# Altium schematic sheet Connectors.SchDoc: Extension connectors
size A4; DocumentNumber: MB1136; Revision: C.3; SheetNumber: 4; SheetTotal: 4; Project: NUCLEO-XXXXRX
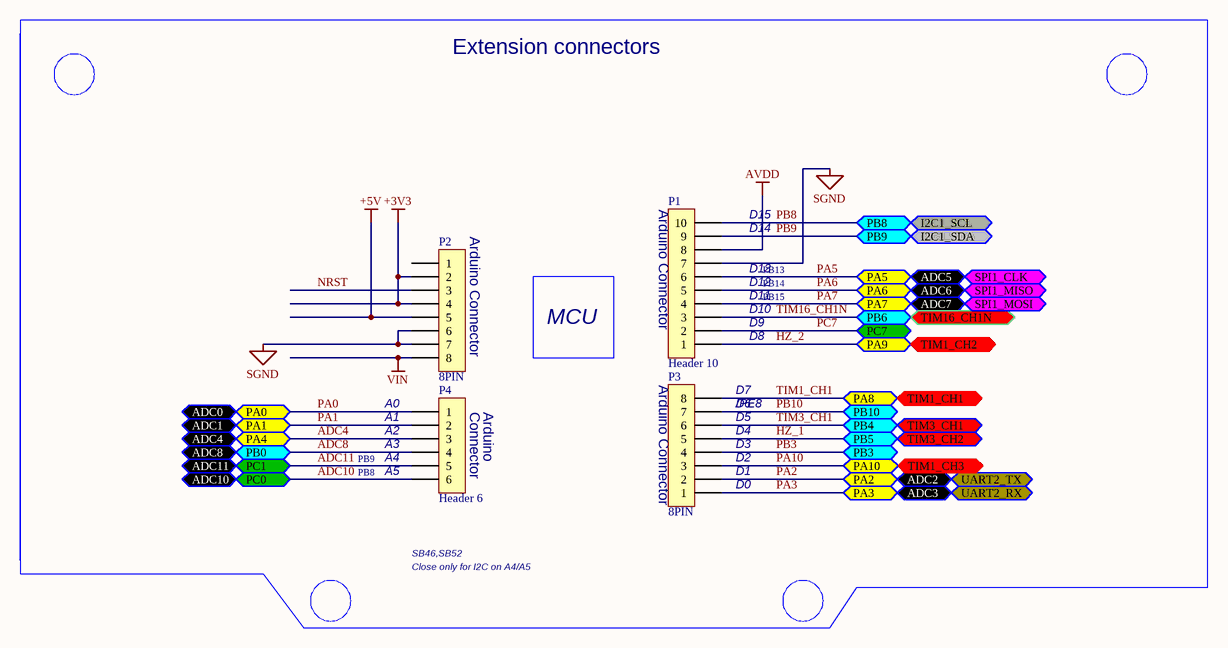
[diagram p0: Connectors.SchDoc]

## Parts
P1  Header 10  [CON10-P2.54]
P2  8PIN  [CON8-P2.54]
P3  8PIN  [CON8-P2.54]
P4  Header 6  [CON6-P2.54]

## Ports
ADC0 (bidir), ADC1 (bidir), ADC2 (bidir), ADC3 (bidir), ADC4 (bidir), ADC5 (bidir), ADC6 (bidir), ADC7 (bidir), ADC8 (bidir), ADC10 (bidir), ADC11 (bidir), I2C1_SCL (bidir), I2C1_SDA (bidir), PA0 (bidir), PA1, PA2, PA3, PA4, PA5, PA6, PA7, PA8, PA9, PA10, PB0, PB3, PB4, PB5, PB6, PB8, PB9, PB10, PC0, PC1, PC7, SPI1_CLK (bidir), SPI1_MISO (bidir), SPI1_MOSI (bidir), TIM1_CH1, TIM1_CH2, TIM1_CH3, TIM3_CH1, TIM3_CH2, TIM16_CH1N, UART2_RX (bidir), UART2_TX (bidir)

## Nets
+3V3: P2.2 P2.4
+5V: P2.5
AVDD: P1.8
SGND: P1.7 P2.6 P2.7
VIN: P2.8
ADC4: P4.3 ; port PA4, port ADC4
ADC8: P4.4 ; port PB0, port ADC8
ADC10: P4.6 ; port PC0, port ADC10
ADC11: P4.5 ; port PC1, port ADC11
HZ_1: P3.5 ; port PB5, port TIM3_CH2
HZ_2: P1.1 ; port PA9, port TIM1_CH2
NRST: P2.3
PA0: P4.1 ; port PA0, port ADC0
PA1: P4.2 ; port PA1, port ADC1
PA2: P3.2 ; port PA2, port ADC2, port UART2_TX
PA3: P3.1 ; port PA3, port ADC3, port UART2_RX
PA5: P1.6 ; port PA5, port ADC5, port SPI1_CLK
PA6: P1.5 ; port PA6, port ADC6, port SPI1_MISO
PA7: P1.4 ; port PA7, port ADC7, port SPI1_MOSI
PA10: P3.3 ; port PA10, port TIM1_CH3
PB3: P3.4 ; port PB3
PB8: P1.10 ; port PB8, port I2C1_SCL
PB9: P1.9 ; port PB9, port I2C1_SDA
PB10: P3.7 ; port PB10
PC7: P1.2 ; port PC7
TIM1_CH1: P3.8 ; port PA8, port TIM1_CH1
TIM3_CH1: P3.6 ; port PB4, port TIM3_CH1
TIM16_CH1N: P1.3 ; port PB6, port TIM16_CH1N

Not connected (* = marked no-connect by the designer): P2 1

## Notes on the sheet
- Extension connectors
- (near P2) Arduino Connector
- (near P1) Arduino Connector
- (near P1) D14
- (near P1) D15
- (near P1) D10
- (near P1) D13
- (near P1) D12
- (near P1) D11
- PB13
- PB14
- PB15
- MCU
- (near P3) Arduino Connector
- (near P1) D8
- (near P1) D9
- A0
- (near P4) A1
- (near P4) A2
- (near P4) A3
- (near P4) Connector
- (near P4) Arduino
- (near P3) D4
- (near P3) D3
- (near P3) D5
- (near P3) D6
- (near P3) D7
- (near P3) /PE8
- PB9
- PB8
- (near P4) A4
- (near P4) A5
- (near P3) D0
- (near P3) D1
- (near P3) D2
- Close only for I2C on A4/A5
- SB46,SB52
- Title:
- Project:
- Size:
- Date:
- Reference:
- Sheet:
- Revision:
- of

## Library data of the parts
P1 = Header 10: Header, 10-Pin; LatestRevisionDate: 17-Jul-2002; LatestRevisionNote: Re-released for DXP Platform.; Publisher: Altium Limited
P2 P3 = Header 8: 连接器; specification: pitch3.96mm VH; LatestRevisionDate: 17-Jul-2002; LatestRevisionNote: Re-released for DXP Platform.; Publisher: Altium Limited; Value: 8PIN
P4 = Header 6: 连接器; Value: 6Pin,; LatestRevisionDate: 17-Jul-2002; LatestRevisionNote: Re-released for DXP Platform.; Publisher: Altium Limited